# EAGLE board FPGA (EAGLE 5.10)
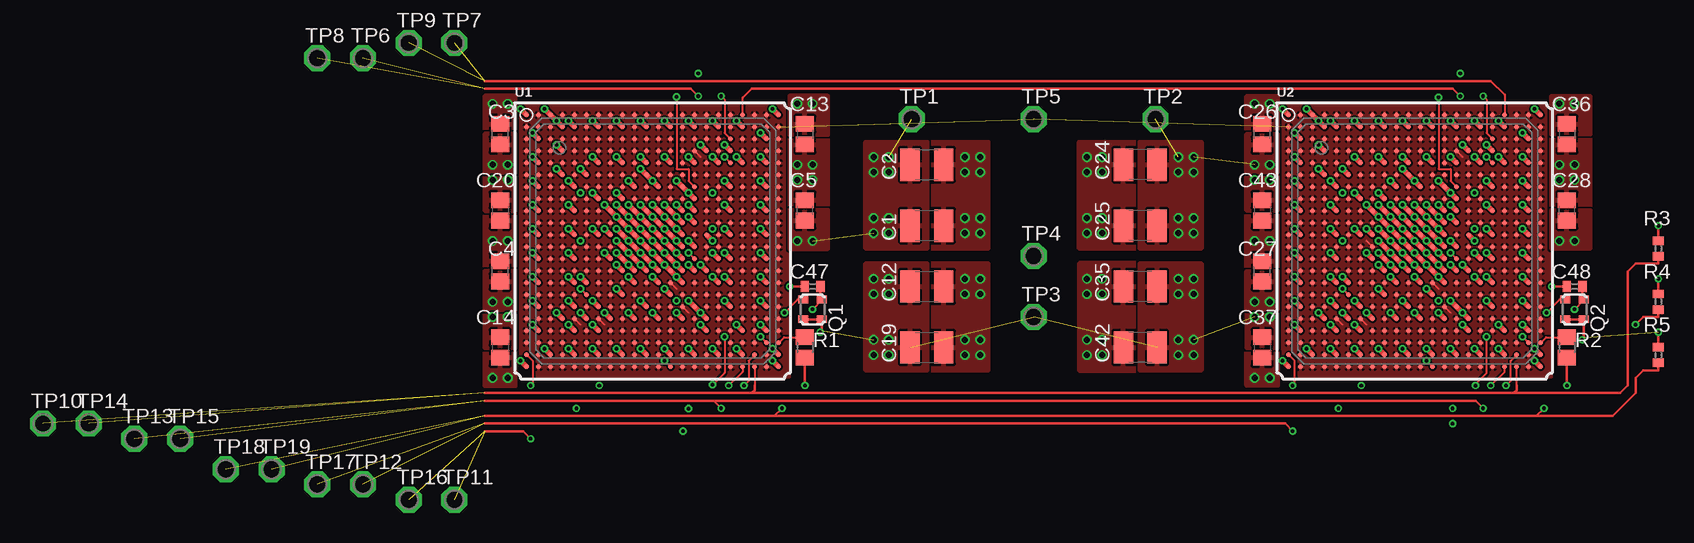
[diagram p5: board, top side]
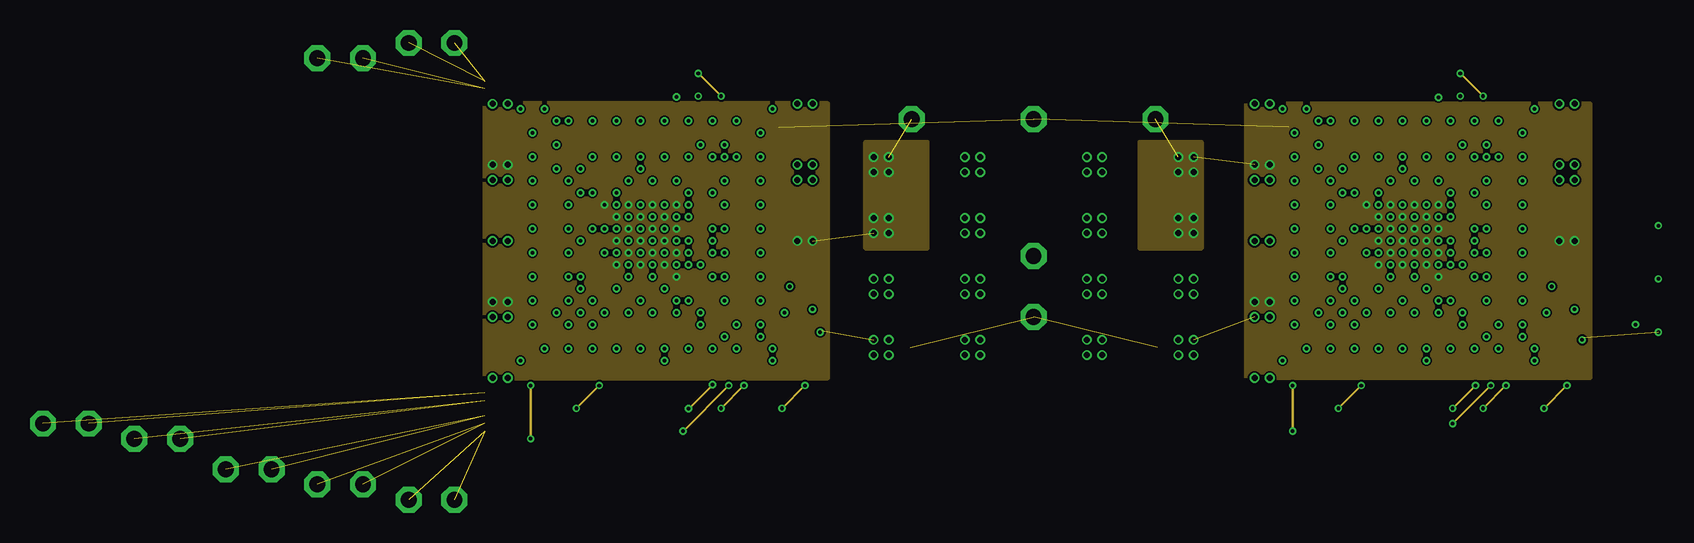
[diagram p6: board, inner layer VCCINT]
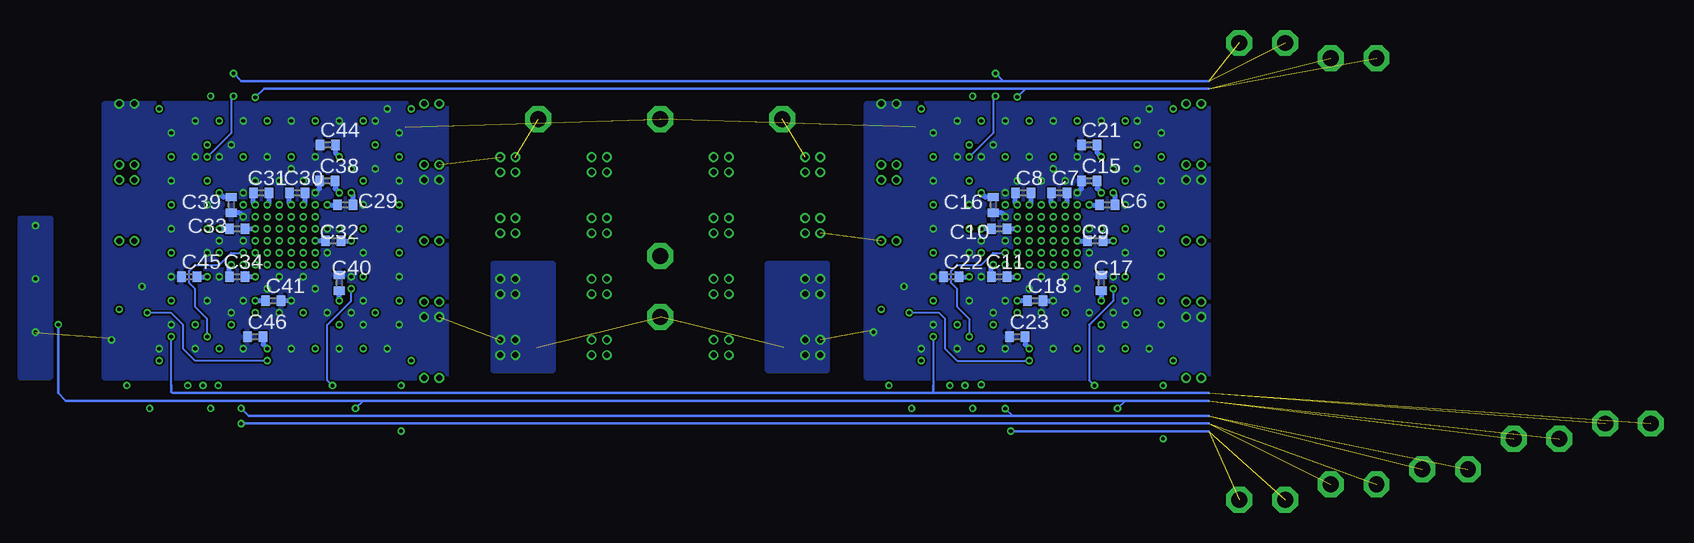
[diagram p7: board, bottom side, seen from below]

No outline drawn. Coordinates in mm, seen from the top.
Copper layers (1+2*15+16): Top 0.035mm / dielectric 0.1mm / $GND 0.035mm / dielectric 0.86mm / VCCINT 0.035mm / dielectric 0.1mm / Bottom 0.035mm
Design rules "pcbcart": minimum track width 0.15mm, minimum drill 0.3mm, track to track 0.15mm, track to pad 0.15mm, pad to pad 0.15mm, via to via 0.15mm, smd to smd 0.15mm, copper to edge 0.3mm, drill to drill 0.2mm, minimum pad ring 0.2mm, minimum via ring 0.15mm, stop-mask expansion 0.075mm, vias tented up to drill 0mil, thermal gap 0.2mm

## Footprints (pad centres in the part's own frame; a part is rotated, then mirrored left to right if it is on the bottom)
C3225 = smd 1.6 x 2.7: 1 -1.4,0; 2 1.4,0
C2012 = smd 1.3 x 1.5: 1 -0.85,0; 2 0.85,0
C1005 = smd 0.7 x 0.9: 1 -0.65,0; 2 0.65,0
ASD = smd 0.65 x 0.85: 1 -0.825,-0.775; 2 0.825,-0.775; 3 0.825,0.775; 4 -0.825,0.775
R2012 = smd 1.3 x 1.5: 1 -0.85,0; 2 0.85,0
R1005 = smd 0.7 x 0.9: 1 -0.65,0; 2 0.65,0
P1-13 = drill 1.321 pad 2.159 octagon: TP 0,0
FG484 = smd 0.4 x 0.4: A1 -10.5,10.5; A2 -9.5,10.5; A3 -8.5,10.5; A4 -7.5,10.5; A5 -6.5,10.5; A6 -5.5,10.5; A7 -4.5,10.5; A8 -3.5,10.5; A9 -2.5,10.5; A10 -1.5,10.5; A11 -0.5,10.5; A12 0.5,10.5; A13 1.5,10.5; A14 2.5,10.5; A15 3.5,10.5; A16 4.5,10.5; A17 5.5,10.5; A18 6.5,10.5; A19 7.5,10.5; A20 8.5,10.5; A21 9.5,10.5; A22 10.5,10.5; AA1 -10.5,-9.5; AA2 -9.5,-9.5; AA3 -8.5,-9.5; AA4 -7.5,-9.5; AA5 -6.5,-9.5; AA6 -5.5,-9.5; AA7 -4.5,-9.5; AA8 -3.5,-9.5; AA9 -2.5,-9.5; AA10 -1.5,-9.5; AA11 -0.5,-9.5; AA12 0.5,-9.5; AA13 1.5,-9.5; AA14 2.5,-9.5; AA15 3.5,-9.5; AA16 4.5,-9.5; AA17 5.5,-9.5; AA18 6.5,-9.5; AA19 7.5,-9.5; AA20 8.5,-9.5; AA21 9.5,-9.5; AA22 10.5,-9.5; AB1 -10.5,-10.5; AB2 -9.5,-10.5; AB3 -8.5,-10.5; AB4 -7.5,-10.5; AB5 -6.5,-10.5; AB6 -5.5,-10.5; AB7 -4.5,-10.5; AB8 -3.5,-10.5; AB9 -2.5,-10.5; AB10 -1.5,-10.5; AB11 -0.5,-10.5; AB12 0.5,-10.5; AB13 1.5,-10.5; AB14 2.5,-10.5; AB15 3.5,-10.5; AB16 4.5,-10.5; AB17 5.5,-10.5; AB18 6.5,-10.5; AB19 7.5,-10.5; AB20 8.5,-10.5; AB21 9.5,-10.5; AB22 10.5,-10.5; B1 -10.5,9.5; B2 -9.5,9.5; B3 -8.5,9.5; B4 -7.5,9.5; B5 -6.5,9.5; B6 -5.5,9.5; B7 -4.5,9.5; B8 -3.5,9.5; B9 -2.5,9.5; B10 -1.5,9.5; B11 -0.5,9.5; B12 0.5,9.5; B13 1.5,9.5; B14 2.5,9.5; B15 3.5,9.5; B16 4.5,9.5; B17 5.5,9.5; B18 6.5,9.5; B19 7.5,9.5; B20 8.5,9.5; B21 9.5,9.5; B22 10.5,9.5; C1 -10.5,8.5; C2 -9.5,8.5; C3 -8.5,8.5; C4 -7.5,8.5; C5 -6.5,8.5; C6 -5.5,8.5; C7 -4.5,8.5; C8 -3.5,8.5; C9 -2.5,8.5; C10 -1.5,8.5; C11 -0.5,8.5; C12 0.5,8.5; C13 1.5,8.5; C14 2.5,8.5; C15 3.5,8.5; C16 4.5,8.5; C17 5.5,8.5; C18 6.5,8.5; C19 7.5,8.5; C20 8.5,8.5; C21 9.5,8.5; C22 10.5,8.5; D1 -10.5,7.5; D2 -9.5,7.5; D3 -8.5,7.5; D4 -7.5,7.5; D5 -6.5,7.5; D6 -5.5,7.5; D7 -4.5,7.5; D8 -3.5,7.5; D9 -2.5,7.5; D10 -1.5,7.5; D11 -0.5,7.5; D12 0.5,7.5; D13 1.5,7.5; D14 2.5,7.5; D15 3.5,7.5; D16 4.5,7.5; D17 5.5,7.5; D18 6.5,7.5; D19 7.5,7.5; D20 8.5,7.5; D21 9.5,7.5; D22 10.5,7.5; E1 -10.5,6.5; E2 -9.5,6.5; E3 -8.5,6.5; E4 -7.5,6.5; E5 -6.5,6.5; E6 -5.5,6.5; E7 -4.5,6.5; E8 -3.5,6.5; E9 -2.5,6.5; E10 -1.5,6.5; E11 -0.5,6.5; E12 0.5,6.5; E13 1.5,6.5; E14 2.5,6.5; E15 3.5,6.5; E16 4.5,6.5; E17 5.5,6.5; E18 6.5,6.5; E19 7.5,6.5; E20 8.5,6.5; E21 9.5,6.5; E22 10.5,6.5; F1 -10.5,5.5; F2 -9.5,5.5; F3 -8.5,5.5; F4 -7.5,5.5; F5 -6.5,5.5; F6 -5.5,5.5; F7 -4.5,5.5; F8 -3.5,5.5; F9 -2.5,5.5; F10 -1.5,5.5; F11 -0.5,5.5; F12 0.5,5.5; F13 1.5,5.5; F14 2.5,5.5; F15 3.5,5.5; F16 4.5,5.5; F17 5.5,5.5; F18 6.5,5.5; F19 7.5,5.5; F20 8.5,5.5; F21 9.5,5.5; F22 10.5,5.5; G1 -10.5,4.5; G2 -9.5,4.5; G3 -8.5,4.5; G4 -7.5,4.5; G5 -6.5,4.5; G6 -5.5,4.5; G7 -4.5,4.5; G8 -3.5,4.5; G9 -2.5,4.5; G10 -1.5,4.5; G11 -0.5,4.5; G12 0.5,4.5; G13 1.5,4.5; G14 2.5,4.5; G15 3.5,4.5; G16 4.5,4.5; G17 5.5,4.5; G18 6.5,4.5; G19 7.5,4.5; G20 8.5,4.5; G21 9.5,4.5; G22 10.5,4.5; H1 -10.5,3.5; H2 -9.5,3.5; H3 -8.5,3.5; H4 -7.5,3.5; H5 -6.5,3.5; H6 -5.5,3.5; H7 -4.5,3.5; H8 -3.5,3.5; H9 -2.5,3.5; H10 -1.5,3.5; H11 -0.5,3.5; H12 0.5,3.5; H13 1.5,3.5; H14 2.5,3.5; H15 3.5,3.5; H16 4.5,3.5; H17 5.5,3.5; H18 6.5,3.5; H19 7.5,3.5; H20 8.5,3.5; H21 9.5,3.5; H22 10.5,3.5; J1 -10.5,2.5; J2 -9.5,2.5; J3 -8.5,2.5; J4 -7.5,2.5; J5 -6.5,2.5; J6 -5.5,2.5; J7 -4.5,2.5; J8 -3.5,2.5; J9 -2.5,2.5; J10 -1.5,2.5; J11 -0.5,2.5; J12 0.5,2.5; J13 1.5,2.5; J14 2.5,2.5; J15 3.5,2.5; J16 4.5,2.5; J17 5.5,2.5; J18 6.5,2.5; J19 7.5,2.5; J20 8.5,2.5; J21 9.5,2.5; J22 10.5,2.5; K1 -10.5,1.5; K2 -9.5,1.5; K3 -8.5,1.5; K4 -7.5,1.5; K5 -6.5,1.5; K6 -5.5,1.5; K7 -4.5,1.5; K8 -3.5,1.5; K9 -2.5,1.5; K10 -1.5,1.5; K11 -0.5,1.5; K12 0.5,1.5; K13 1.5,1.5; K14 2.5,1.5; K15 3.5,1.5; K16 4.5,1.5; K17 5.5,1.5; K18 6.5,1.5; K19 7.5,1.5; K20 8.5,1.5; K21 9.5,1.5; K22 10.5,1.5; L1 -10.5,0.5; L2 -9.5,0.5; L3 -8.5,0.5; L4 -7.5,0.5; L5 -6.5,0.5; L6 -5.5,0.5; L7 -4.5,0.5; L8 -3.5,0.5; L9 -2.5,0.5; L10 -1.5,0.5; L11 -0.5,0.5; L12 0.5,0.5; L13 1.5,0.5; L14 2.5,0.5; L15 3.5,0.5; L16 4.5,0.5; L17 5.5,0.5; L18 6.5,0.5; L19 7.5,0.5; L20 8.5,0.5; L21 9.5,0.5; L22 10.5,0.5; M1 -10.5,-0.5; M2 -9.5,-0.5; M3 -8.5,-0.5; M4 -7.5,-0.5; M5 -6.5,-0.5; M6 -5.5,-0.5; M7 -4.5,-0.5; M8 -3.5,-0.5; M9 -2.5,-0.5; M10 -1.5,-0.5; M11 -0.5,-0.5; M12 0.5,-0.5; M13 1.5,-0.5; M14 2.5,-0.5; M15 3.5,-0.5; M16 4.5,-0.5; M17 5.5,-0.5; M18 6.5,-0.5; M19 7.5,-0.5; M20 8.5,-0.5; M21 9.5,-0.5; M22 10.5,-0.5; N1 -10.5,-1.5; N2 -9.5,-1.5; N3 -8.5,-1.5; N4 -7.5,-1.5; N5 -6.5,-1.5; N6 -5.5,-1.5; N7 -4.5,-1.5; N8 -3.5,-1.5; N9 -2.5,-1.5; N10 -1.5,-1.5; N11 -0.5,-1.5; N12 0.5,-1.5; N13 1.5,-1.5; N14 2.5,-1.5; N15 3.5,-1.5; N16 4.5,-1.5; N17 5.5,-1.5; N18 6.5,-1.5; N19 7.5,-1.5; N20 8.5,-1.5; N21 9.5,-1.5; N22 10.5,-1.5; P1 -10.5,-2.5; P2 -9.5,-2.5; P3 -8.5,-2.5; P4 -7.5,-2.5; P5 -6.5,-2.5; P6 -5.5,-2.5; P7 -4.5,-2.5; P8 -3.5,-2.5; P9 -2.5,-2.5; P10 -1.5,-2.5; P11 -0.5,-2.5; P12 0.5,-2.5; P13 1.5,-2.5; P14 2.5,-2.5; P15 3.5,-2.5; P16 4.5,-2.5; P17 5.5,-2.5; P18 6.5,-2.5; P19 7.5,-2.5; P20 8.5,-2.5; P21 9.5,-2.5; P22 10.5,-2.5; R1 -10.5,-3.5; R2 -9.5,-3.5; R3 -8.5,-3.5; R4 -7.5,-3.5; R5 -6.5,-3.5; R6 -5.5,-3.5; R7 -4.5,-3.5; R8 -3.5,-3.5; R9 -2.5,-3.5; R10 -1.5,-3.5; R11 -0.5,-3.5; R12 0.5,-3.5; R13 1.5,-3.5; R14 2.5,-3.5; R15 3.5,-3.5; R16 4.5,-3.5; R17 5.5,-3.5; R18 6.5,-3.5; R19 7.5,-3.5; R20 8.5,-3.5; R21 9.5,-3.5; R22 10.5,-3.5; T1 -10.5,-4.5; T2 -9.5,-4.5; T3 -8.5,-4.5; T4 -7.5,-4.5; T5 -6.5,-4.5; T6 -5.5,-4.5; T7 -4.5,-4.5; T8 -3.5,-4.5; T9 -2.5,-4.5; T10 -1.5,-4.5; T11 -0.5,-4.5; T12 0.5,-4.5; T13 1.5,-4.5; T14 2.5,-4.5; T15 3.5,-4.5; T16 4.5,-4.5; T17 5.5,-4.5; T18 6.5,-4.5; T19 7.5,-4.5; T20 8.5,-4.5; T21 9.5,-4.5; T22 10.5,-4.5; U1 -10.5,-5.5; U2 -9.5,-5.5; U3 -8.5,-5.5; U4 -7.5,-5.5; U5 -6.5,-5.5; U6 -5.5,-5.5; U7 -4.5,-5.5; U8 -3.5,-5.5; U9 -2.5,-5.5; U10 -1.5,-5.5; U11 -0.5,-5.5; U12 0.5,-5.5; U13 1.5,-5.5; U14 2.5,-5.5; U15 3.5,-5.5; U16 4.5,-5.5; U17 5.5,-5.5; U18 6.5,-5.5; U19 7.5,-5.5; U20 8.5,-5.5; U21 9.5,-5.5; U22 10.5,-5.5; V1 -10.5,-6.5; V2 -9.5,-6.5; V3 -8.5,-6.5; V4 -7.5,-6.5; V5 -6.5,-6.5; V6 -5.5,-6.5; V7 -4.5,-6.5; V8 -3.5,-6.5; V9 -2.5,-6.5; V10 -1.5,-6.5; V11 -0.5,-6.5; V12 0.5,-6.5; V13 1.5,-6.5; V14 2.5,-6.5; V15 3.5,-6.5; V16 4.5,-6.5; V17 5.5,-6.5; V18 6.5,-6.5; V19 7.5,-6.5; V20 8.5,-6.5; V21 9.5,-6.5; V22 10.5,-6.5; W1 -10.5,-7.5; W2 -9.5,-7.5; W3 -8.5,-7.5; W4 -7.5,-7.5; W5 -6.5,-7.5; W6 -5.5,-7.5; W7 -4.5,-7.5; W8 -3.5,-7.5; W9 -2.5,-7.5; W10 -1.5,-7.5; W11 -0.5,-7.5; W12 0.5,-7.5; W13 1.5,-7.5; W14 2.5,-7.5; W15 3.5,-7.5; W16 4.5,-7.5; W17 5.5,-7.5; W18 6.5,-7.5; W19 7.5,-7.5; W20 8.5,-7.5; W21 9.5,-7.5; W22 10.5,-7.5; Y1 -10.5,-8.5; Y2 -9.5,-8.5; Y3 -8.5,-8.5; Y4 -7.5,-8.5; Y5 -6.5,-8.5; Y6 -5.5,-8.5; Y7 -4.5,-8.5; Y8 -3.5,-8.5; Y9 -2.5,-8.5; Y10 -1.5,-8.5; Y11 -0.5,-8.5; Y12 0.5,-8.5; Y13 1.5,-8.5; Y14 2.5,-8.5; Y15 3.5,-8.5; Y16 4.5,-8.5; Y17 5.5,-8.5; Y18 6.5,-8.5; Y19 7.5,-8.5; Y20 8.5,-8.5; Y21 9.5,-8.5; Y22 10.5,-8.5

## Placement (x,y rotation side)
C1  100u  [C3225]  22.86,1.27 0 top
C2  100u  [C3225]  22.86,6.35 0 top
C3  4u7  [C2012]  -12.7,8.89 90 top
C4  4u7  [C2012]  -12.7,-2.54 90 top
C5  4u7  [C2012]  12.7,2.54 90 top
C6  470n  [C1005]  -5.5,3 0 bottom
C7  470n  [C1005]  -1.5,4 180 bottom
C8  470n  [C1005]  1.5,4 0 bottom
C9  470n  [C1005]  -4.5,0 0 bottom
C10  470n  [C1005]  3.5,1 180 bottom
C11  470n  [C1005]  3.5,-3 180 bottom
C12  100u  [C3225]  22.86,-3.81 0 top
C13  4u7  [C2012]  12.7,8.89 270 top
C14  4u7  [C2012]  -12.7,-8.89 270 top
C15  470n  [C1005]  -4,5 0 bottom
C16  470n  [C1005]  4,3 90 bottom
C17  470n  [C1005]  -5,-3.5 270 bottom
C18  470n  [C1005]  0.5,-5 180 bottom
C19  100u  [C3225]  22.86,-8.89 0 top
C20  4u7  [C2012]  -12.7,2.54 270 top
C21  470n  [C1005]  -4,8 0 bottom
C22  470n  [C1005]  7.5,-3 0 bottom
C23  470n  [C1005]  2,-8 0 bottom
C24  100u  [C3225]  40.64,6.35 180 top
C25  100u  [C3225]  40.64,1.27 180 top
C26  4u7  [C2012]  50.8,8.89 90 top
C27  4u7  [C2012]  50.8,-2.54 90 top
C28  4u7  [C2012]  76.2,2.54 90 top
C29  470n  [C1005]  58,3 0 bottom
C30  470n  [C1005]  62,4 180 bottom
C31  470n  [C1005]  65,4 0 bottom
C32  470n  [C1005]  59,0 0 bottom
C33  470n  [C1005]  67,1 180 bottom
C34  470n  [C1005]  67,-3 180 bottom
C35  100u  [C3225]  40.64,-3.81 180 top
C36  4u7  [C2012]  76.2,8.89 270 top
C37  4u7  [C2012]  50.8,-8.89 270 top
C38  470n  [C1005]  59.5,5 0 bottom
C39  470n  [C1005]  67.5,3 90 bottom
C40  470n  [C1005]  58.5,-3.5 270 bottom
C41  470n  [C1005]  64,-5 180 bottom
C42  100u  [C3225]  40.64,-8.89 180 top
C43  4u7  [C2012]  50.8,2.54 270 top
C44  470n  [C1005]  59.45,8 0 bottom
C45  470n  [C1005]  71,-3 0 bottom
C46  470n  [C1005]  65.5,-8 0 bottom
C47  470n  [C1005]  13.34,-3.81 0 top
C48  470n  [C1005]  76.83,-3.81 0 top
Q1  ASDMB@100MHZ  [ASD]  13.34,-5.71 90 top
Q2  ASDMB@100MHZ  [ASD]  76.83,-5.71 90 top
R1  0R  [R2012]  12.7,-8.89 270 top
R2  0R  [R2012]  76.2,-8.89 270 top
R3  4k7  [R1005]  83.82,-0.64 90 top
R4  4k7  [R1005]  83.82,-5.08 90 top
R5  4k7  [R1005]  83.82,-9.53 90 top
TP1  TPPAD1-13  [P1-13]  21.59,10.16 0 top
TP2  TPPAD1-13  [P1-13]  41.91,10.16 0 top
TP3  TPPAD1-13  [P1-13]  31.75,-6.35 0 top
TP4  TPPAD1-13  [P1-13]  31.75,-1.27 0 top
TP5  TPPAD1-13  [P1-13]  31.75,10.16 0 top
TP6  TPPAD1-13  [P1-13]  -24.13,15.24 0 top
TP7  TPPAD1-13  [P1-13]  -16.51,16.51 0 top
TP8  TPPAD1-13  [P1-13]  -27.94,15.24 0 top
TP9  TPPAD1-13  [P1-13]  -20.32,16.51 0 top
TP10  TPPAD1-13  [P1-13]  -50.8,-15.24 0 top
TP11  TPPAD1-13  [P1-13]  -16.51,-21.59 0 top
TP12  TPPAD1-13  [P1-13]  -24.13,-20.32 0 top
TP13  TPPAD1-13  [P1-13]  -43.18,-16.51 0 top
TP14  TPPAD1-13  [P1-13]  -46.99,-15.24 0 top
TP15  TPPAD1-13  [P1-13]  -39.37,-16.51 0 top
TP16  TPPAD1-13  [P1-13]  -20.32,-21.59 0 top
TP17  TPPAD1-13  [P1-13]  -27.94,-20.32 0 top
TP18  TPPAD1-13  [P1-13]  -35.56,-19.05 0 top
TP19  TPPAD1-13  [P1-13]  -31.75,-19.05 0 top
U1  6SLX150FGG484  [FG484]  0,0 0 top
U2  6SLX150FGG484  [FG484]  63.5,0 0 top

## Tracks (layer width: path | path; a pad name or v marks a point on that pad's centre or on a via)
!IRQ  (via drill 0.3)  (1 unrouted)
  Top 0.15: v57.5,-4 U2.T6 | U1.T6 v-6,-4
  Top 0.2: v81.92,-6.99 82.55,-6.35 83.82,-6.35 R4.1
  VCCINT 0.2: v-4.45,-12.06 v-6.35,-13.97 | v57.15,-13.97 v59.05,-12.06
  Bottom 0.15: v57.5,-4 57.5,-5 59.5,-7 59.5,-11.62 v59.05,-12.06 | v-6,-4 -6,-5 -4,-7 -4,-11.62 v-4.45,-12.06
  Bottom 0.2: -6.99,-13.34 56.52,-13.34 | v-6.35,-13.97 -6.99,-13.34 | -6.99,-13.34 -13.97,-13.34 | 56.52,-13.34 v57.15,-13.97 | 56.52,-13.34 81.28,-13.34 81.92,-12.7 v81.92,-6.99
!PROGRAM0  (via drill 0.3)  (1 unrouted)
  Top 0.15: U1.AA1 -10,-10 -10,-11.9 v-10.16,-12.06
  Top 0.2: -13.97,-15.88 -10.79,-15.88 v-10.16,-16.51
  VCCINT 0.2: v-10.16,-12.06 v-10.16,-16.51
!PROGRAM1  (via drill 0.3)  (1 unrouted)
  Top 0.15: U2.AA1 53.5,-10 53.5,-11.9 v53.34,-12.06
  Top 0.2: -13.97,-15.24 52.7,-15.24 v53.34,-15.88
  VCCINT 0.2: v53.34,-15.88 v53.34,-12.06
CLK0  (via drill 0.3)
  Top 0.15: v1,-10 U1.AB13
  Top 0.2: v11,-6 12.11,-4.89 Q1.3
  Bottom 0.15: v1,-10 7,-10 8,-9 8,-6.5 8.5,-6 v11,-6
CLK1  (via drill 0.3)
  Top 0.15: U2.AB13 v64.5,-10
  Top 0.2: v74.5,-6 75.61,-4.89 Q2.3
  Bottom 0.15: v64.5,-10 70.5,-10 71.5,-9 71.5,-7 72.5,-6 v74.5,-6
DONE  (via drill 0.3)  (1 unrouted)
  Top 0.2: 10.16,-14.61 -13.97,-14.61 | 10.16,-14.61 73.66,-14.61 | v12.7,-12.06 R1.2 | v10.79,-13.97 10.16,-14.61 | v76.2,-12.06 R2.2 | 73.66,-14.61 v74.3,-13.97 | R5.1 83.82,-10.79 82.55,-10.79 81.92,-11.43 81.92,-12.7 80.01,-14.61 73.66,-14.61
  VCCINT 0.2: v10.79,-13.97 v12.7,-12.06 | v74.3,-13.97 v76.2,-12.06
DONE_0
  Top 0.15: U1.Y22 10.96,-8.04 R1.1
DONE_1
  Top 0.15: U2.Y22 74.46,-8.04 R2.1
GND  (via drill 0.3, 0.5)
  Top 0.2: v13.34,-5.71 14.16,-4.89 Q1.2 13.98,-4.76 C47.2 | C48.2 77.48,-4.76 Q2.2 77.61,-4.94 v76.83,-5.71
  Top 0.4: v-11,-10 U1.AB1 | U1.AA5 v-7,-9 | U1.W7 v-5,-7 | U1.AA9 v-3,-9 | v1,-9 U1.AA13 | U1.AA17 v5,-9 | U1.W16 v4,-7 | U1.V14 v2,-6 | U1.V10 v-2,-6 | v-5,-5 U1.U7 | U1.V4 v-8,-6 | v-10,-5 U1.U2 | U1.R5 v-7,-3 | U1.N2 v-10,-1 | U1.L5 v-7,1 | v-10,3 U1.J2 | U1.E2 v-10,7 | U1.D4 v-8,8 | U1.B5 v-7,10 | U1.E7 v-5,7 | U1.G5 v-7,5 | v-3,10 U1.B9 | U1.E11 v-1,7 | U1.B13 v1,10 | v5,10 U1.B17 | v10,11 U1.A22 | U1.E21 v9,7 | U1.D18 v6,8 | U1.E15 v3,7 | U1.G18 v6,5 | U1.J21 v9,3 | U1.L18 v6,1 | U1.N21 v9,-1 | v5,-1 U1.N17 | U1.U21 v9,-5 | U1.W19 v7,-7 | U1.AB22 v10,-10 | v-5,4 U1.H7 | U1.J15 v3,3 | U1.K14 v2,2 U1.J13 v1,3 | U1.M14 v2,0 U1.L13 v1,1 U1.K12 v0,2 U1.J11 v-1,3 | v4,-2 U1.P16 | v6,-3 U1.R18 | U1.P15 v3,-2 | U1.P14 v2,-2 U1.N13 v1,-1 U1.M12 v0,0 U1.L11 v-1,1 U1.K10 v-2,2 U1.J9 v-3,3 | v-3,1 U1.L9 v-2,0 U1.M10 v-1,-1 U1.N11 v0,-2 U1.P12 | U1.P10 v-2,-2 U1.N9 v-3,-1 | U1.A1 v-11,11 | U2.AB1 v52.5,-10 | U2.AA5 v56.5,-9 | U2.W7 v58.5,-7 | v60.5,-9 U2.AA9 | v64.5,-9 U2.AA13 | v68.5,-9 U2.AA17 | U2.W16 v67.5,-7 | U2.V14 v65.5,-6 | U2.V10 v61.5,-6 | U2.U7 v58.5,-5 | v55.5,-6 U2.V4 | U2.U2 v53.5,-5 | U2.R5 v56.5,-3 | U2.N2 v53.5,-1 | U2.L5 v56.5,1 | U2.J2 v53.5,3 | U2.E2 v53.5,7 | U2.D4 v55.5,8 | U2.B5 v56.5,10 | U2.E7 v58.5,7 | U2.G5 v56.5,5 | v60.5,10 U2.B9 | U2.E11 v62.5,7 | U2.B13 v64.5,10 | v68.5,10 U2.B17 | v73.5,11 U2.A22 | U2.E21 v72.5,7 | U2.D18 v69.5,8 | U2.E15 v66.5,7 | U2.G18 v69.5,5 | U2.J21 v72.5,3 | U2.L18 v69.5,1 | U2.N21 v72.5,-1 | v68.5,-1 U2.N17 | U2.U21 v72.5,-5 | U2.W19 v70.5,-7 | U2.AB22 v73.5,-10 | v58.5,4 U2.H7 | U2.J15 v66.5,3 | U2.K14 v65.5,2 U2.J13 v64.5,3 | U2.M14 v65.5,0 U2.L13 v64.5,1 U2.K12 v63.5,2 U2.J11 v62.5,3 | v67.5,-2 U2.P16 | v69.5,-3 U2.R18 | U2.P15 v66.5,-2 | U2.P14 v65.5,-2 U2.N13 v64.5,-1 U2.M12 v63.5,0 U2.L11 v62.5,1 U2.K10 v61.5,2 U2.J9 v60.5,3
  Top 0.4: v60.5,1 U2.L9 v61.5,0 U2.M10 v62.5,-1 U2.N11 v63.5,-2 U2.P12 | U2.P10 v61.5,-2 U2.N9 v60.5,-1 | U2.A1 v52.5,11
  Bottom 0.4: C15.2 -4.65,4.35 v-5,4 | C22.2 v6,-3 | C11.2 4.15,-2.15 v4,-2 | C8.2 0.85,3.15 v1,3 | C7.2 -0.85,3.15 v-1,3 | C17.2 v-5,-5 | C38.2 58.85,4.35 v58.5,4 | C45.2 v69.5,-3 | C34.2 67.65,-2.15 v67.5,-2 | C31.2 64.35,3.15 v64.5,3 | C30.2 62.65,3.15 v62.5,3 | v58.5,-5 C40.2 | C9.2 v-6,0 | C10.2 v5,1 | C21.2 -4.65,7.35 v-5,7 | C6.2 -6.15,3.85 v-6,4 | C23.2 1.35,-8.65 v1,-9 | C18.2 v2,-5 | C16.2 4.65,3.65 v5,4 | C44.2 58.8,7.3 v58.5,7 | C32.2 v57.5,0 | C29.2 57.35,3.85 v57.5,4 | C41.2 v65.5,-5 | C46.2 64.85,-8.65 v64.5,-9 | C33.2 v68.5,1 | C39.2 68.15,3.65 v68.5,4
  other vias: 12.06,5.08 12.06,6.35 13.34,5.08 13.34,6.35 -13.34,11.43 -12.06,11.43 -13.34,0 -12.06,0 -12.06,-11.43 -13.34,-11.43 51.44,-11.43 50.16,-11.43 50.16,0 51.44,0 51.44,11.43 50.16,11.43 76.83,6.35 75.56,6.35 75.56,5.08 76.83,5.08 26.04,0.64 27.3,0.64 27.3,1.91 26.04,1.91 26.04,5.71 27.3,5.71 27.3,6.99 26.04,6.99 26.04,-3.17 27.3,-3.17 27.3,-4.45 26.04,-4.45 26.04,-8.26 27.3,-8.26 27.3,-9.53 26.04,-9.53 37.47,6.99 36.2,6.99 36.2,5.71 37.47,5.71 37.47,1.91 36.2,0.64 36.2,1.91 37.47,0.64 36.2,-3.17 37.47,-4.45 37.47,-3.17 36.2,-4.45 36.2,-8.26 37.47,-9.53 36.2,-9.53 37.47,-8.26
  pour Top (rank 3): -13.97,-8.89 -13.97,-12.06 -11.43,-12.06 -11.43,-8.89
  pour Top (rank 3): -13.97,2.54 -13.97,-2.54 -11.43,-2.54 -11.43,2.54
  pour Top (rank 3): -13.97,12.06 -13.97,8.89 -11.43,8.89 -11.43,12.06
  pour Top (rank 3): 11.43,8.89 11.43,2.54 14.61,2.54 14.61,8.89
  pour Top (rank 3): 49.53,12.06 52.07,12.06 52.07,8.89 49.53,8.89
  pour Top (rank 3): 49.53,2.54 52.07,2.54 52.07,-2.54 49.53,-2.54
  pour Top (rank 3): 49.53,-8.89 52.07,-8.89 52.07,-12.06 49.53,-12.06
  pour Top (rank 3): 74.93,8.89 78.11,8.89 78.11,2.54 74.93,2.54
  pour Top (rank 3): 22.86,8.26 27.94,8.26 27.94,-0.64 22.86,-0.64
  pour Top (rank 3): 22.86,-1.91 27.94,-1.91 27.94,-10.79 22.86,-10.79
  pour Top (rank 3): 40.64,-1.91 35.56,-1.91 35.56,-10.79 40.64,-10.79
  pour Top (rank 3): 40.64,-0.64 35.56,-0.64 35.56,8.26 40.64,8.26
MISO_F  (1 unrouted)
  Top 0.15: U1.AB20 8.5,-12.06 | 72,-12.06 U2.AB20
  Top 0.2: 8.26,-12.7 71.75,-12.7 | 71.75,-12.7 80.64,-12.7 81.28,-12.06 81.28,-2.54 81.92,-1.91 83.82,-1.91 R3.1 | 8.26,-12.7 -13.97,-12.7 | 8.5,-12.06 8.5,-12.46 8.26,-12.7 | 72,-12.06 72,-12.46 71.75,-12.7
MOSI_F  (via drill 0.3)  (1 unrouted)
  Top 0.15: U2.AA20 71.5,-10 71.5,-11.69 v71.12,-12.06 | U1.AA20 8,-10 8,-11.69 v7.62,-12.06
  Top 0.2: 5.08,-13.34 -13.97,-13.34 | 5.08,-13.34 68.58,-13.34 v69.22,-13.97 | v5.71,-13.97 5.08,-13.34
  VCCINT 0.2: v7.62,-12.06 v5.71,-13.97 | v69.22,-13.97 v71.12,-12.06
NC  (2 unrouted)
  Top 0.15: U2.R13 65.5,-4 | U2.M8 59.5,0 | U2.V7 59.5,-7 | U2.V5 57.5,-7 | U2.D15 67.5,7 | U2.U14 66.5,-6 | U1.V5 -6,-7 | U1.V7 -4,-7 | 3,-6 U1.U14 | U1.R13 2,-4 | U1.D15 4,7
  pour Top (rank 4): -11.43,11.43 11.43,11.43 11.43,-11.43 -11.43,-11.43
  pour Top (rank 4): 52.07,11.43 74.93,11.43 74.93,-11.43 52.07,-11.43
SCLK_F  (via drill 0.3)  (1 unrouted)
  Top 0.15: v72.5,-8 U2.Y21 | U1.Y21 v9,-8
  Bottom 0.15: 72.5,-12.06 v72.5,-8 | v9,-8 9,-12.06
  Bottom 0.2: 8.89,-12.7 -13.97,-12.7 | 8.89,-12.7 72.39,-12.7 72.5,-12.59 72.5,-12.06 | 9,-12.06 9,-12.59 8.89,-12.7
SSEL_F0  (via drill 0.3)  (1 unrouted)
  Top 0.15: v6.35,-12.06 7.5,-10.91 U1.AB19
  VCCINT 0.2: v6.35,-12.06 v2.54,-15.88
  Bottom 0.2: v2.54,-15.88 -13.97,-15.88
SSEL_F1  (via drill 0.3)  (1 unrouted)
  Top 0.15: v69.85,-12.06 71,-10.91 U2.AB19
  VCCINT 0.2: v66.67,-15.24 v69.85,-12.06
  Bottom 0.2: -13.97,-15.24 v66.67,-15.24
SUSPEND  (via drill 0.3)  (1 unrouted)
  Top 0.15: v3,-1 U1.N15 | v6,-8 6,-11 v5,-12 | v66.5,-1 U2.N15 | v69.5,-8 69.5,-11 68.58,-11.92 v68.58,-12.06
  VCCINT 0.2: v5,-12 v3,-14 | v66.67,-13.97 v68.58,-12.06
  Bottom 0.15: v3,-1 4,-1 5,-2 7,-2 7.5,-2.5 7.5,-3.5 7,-4 7,-5.5 6,-6.5 v6,-8 | v66.5,-1 67.5,-1 68.5,-2 70.5,-2 71,-2.5 71,-3.5 70.5,-4 70.5,-5.5 69.5,-6.5 v69.5,-8
  Bottom 0.2: v3,-14 2.4,-14.61 | 2.4,-14.61 -13.97,-14.61 | v66.67,-13.97 66.04,-14.61 2.4,-14.61
TCK  (via drill 0.3)  (1 unrouted)
  Top 0.15: U2.G15 66.5,5 66.5,6 65.5,6 v65.5,11.97 | U1.G15 3,5 3,6 2,6 v2,12
  Bottom 0.2: 1.3,12.7 v2,12 | -13.97,12.7 1.3,12.7 | 1.3,12.7 64.77,12.7 v65.5,11.97
TDI0  (via drill 0.3)  (1 unrouted)
  Top 0.15: v6,7 U1.E18
  Top 0.2: v3.81,12.06 3.17,12.7 -13.97,12.7
  Bottom 0.15: v6,7 4,9 4,11.88 v3.81,12.06
TDO0I1  (via drill 0.3)
  Top 0.15: U1.A19 7.5,11.95 | v69.5,7 U2.E18
  Top 0.2: 7.5,11.95 8.26,12.7 66.67,12.7 v67.31,12.06
  Bottom 0.15: v69.5,7 67.5,9 67.5,11.88 v67.31,12.06
TDO1  (1 unrouted)
  Top 0.15: 71,12.19 U2.A19
  Top 0.2: -13.97,13.34 69.85,13.34 71,12.19
TMS  (via drill 0.3)  (1 unrouted)
  Top 0.15: U2.C18 69.5,9 69.5,11.78 v69.22,12.06 | U1.C18 6,9 6,11.78 v5.71,12.06
  VCCINT 0.2: v3.81,13.97 v5.71,12.06 | v67.31,13.97 v69.22,12.06
  Bottom 0.2: -13.97,13.34 3.17,13.34 | 3.17,13.34 66.67,13.34 v67.31,13.97 | 3.17,13.34 v3.81,13.97
VCCINT0  (via drill 0.3, 0.5)  (2 unrouted)
  Top 0.4: v-2,3 U1.J10 v-1,2 U1.K11 v0,1 U1.L12 v1,0 U1.M13 v2,-1 U1.N14 | U1.R14 v2,-3 U1.P13 v1,-2 U1.N12 v0,-1 U1.M11 v-1,0 U1.L10 v-2,1 U1.K9 v-3,2 U1.J8 v-4,3 | U1.P11 v-1,-2 U1.N10 v-2,-1 U1.M9 v-3,0 | U1.P9 v-3,-2 | U1.L14 v2,1 U1.K13 v1,2 U1.J12 v0,3 | U1.J14 v2,3
  Bottom 0.4: C11.1 v2,-3 | C7.1 -2.15,3.15 v-2,3 | C8.1 2.15,3.15 v2,3 | v-3,0 C9.1 | v2,1 C10.1 | v-4,3 C6.1
  other vias: 12.06,0 13.34,0 -13.34,-5.08 -12.06,-5.08 -13.34,6.35 -12.06,6.35 18.41,6.99 19.68,6.99 19.68,5.71 18.41,5.71 18.41,1.91 18.41,0.64 19.68,0.64 19.68,1.91
  pour VCCINT: 14.61,11.43 -13.97,11.43 -13.97,-11.43 14.61,-11.43
  pour Top: -13.97,-2.54 -13.97,-5.71 -11.43,-5.71 -11.43,-2.54
  pour Top: -13.97,8.89 -13.97,5.71 -11.43,5.71 -11.43,8.89
  pour Top: 11.43,2.54 11.43,-0.64 14.61,-0.64 14.61,2.54
  pour Top: 17.78,8.26 22.86,8.26 22.86,-0.64 17.78,-0.64
  pour VCCINT: 17.78,8.26 22.86,8.26 22.86,-0.64 17.78,-0.64
VCCINT1  (via drill 0.3, 0.5)  (2 unrouted)
  Top 0.4: v61.5,3 U2.J10 v62.5,2 U2.K11 v63.5,1 U2.L12 v64.5,0 U2.M13 v65.5,-1 U2.N14 | U2.R14 v65.5,-3 U2.P13 v64.5,-2 U2.N12 v63.5,-1 U2.M11 v62.5,0 U2.L10 v61.5,1 U2.K9 v60.5,2 U2.J8 v59.5,3 | U2.P11 v62.5,-2 U2.N10 v61.5,-1 U2.M9 v60.5,0 | v60.5,-2 U2.P9 | U2.L14 v65.5,1 U2.K13 v64.5,2 U2.J12 v63.5,3 | U2.J14 v65.5,3
  Bottom 0.4: C32.1 v60.5,0 | v65.5,-3 C34.1 | v65.5,1 C33.1 | C30.1 61.35,3.15 v61.5,3 | C31.1 65.65,3.15 v65.5,3 | v59.5,3 C29.1
  other vias: 76.83,0 75.56,0 50.16,-5.08 51.44,-5.08 50.16,6.35 51.44,6.35 45.09,0.64 43.81,0.64 43.81,1.91 45.09,1.91 45.09,5.71 43.81,5.71 43.81,6.99 45.09,6.99
  pour VCCINT: 49.53,11.43 78.11,11.43 78.11,-11.43 49.53,-11.43
  pour Top: 74.93,2.54 78.11,2.54 78.11,-0.64 74.93,-0.64
  pour Top: 49.53,-2.54 52.07,-2.54 52.07,-5.71 49.53,-5.71
  pour Top: 49.53,8.89 52.07,8.89 52.07,5.71 49.53,5.71
  pour Top: 40.64,8.26 45.72,8.26 45.72,-0.64 40.64,-0.64
  pour VCCINT: 40.64,8.26 45.72,8.26 45.72,-0.64 40.64,-0.64
VCCIO  (via drill 0.3, 0.5)  (5 unrouted)
  Top 0.2: R5.2 v83.82,-7.62 | R4.2 v83.82,-3.17 | R3.2 v83.82,1.27 | C48.1 v74.93,-3.81 | C47.1 v11.43,-3.81 | Q1.4 Q1.1 14.11,-7.48 v13.97,-7.62 | Q2.4 Q2.1 77.61,-8.12 v77.47,-8.26
  Top 0.4: U1.E13 v1,7 | v2,5 U1.G14 v3,4 U1.H15 | U1.L16 v5,0 | U1.J18 v6,3 | U1.N18 v6,-1 | U1.L21 v9,1 | U1.G21 v9,5 | U1.E19 v7,7 | v5,7 U1.E17 | U1.C21 v9,9 | U1.B19 v7,10 | U1.B15 v3,10 | U1.B11 v-1,10 | U1.B7 v-5,10 | U1.F6 v-6,6 | v-8,10 U1.B4 | v-8,10 U1.A3 | v-8,10 v-9,11 | U1.C2 v-10,9 | v-3,7 U1.E9 | U1.F4 v-8,6 | U1.G2 v-10,5 | v-7,3 U1.J5 | U1.L7 v-5,1 | U1.L2 v-10,1 | U1.N5 v-7,-1 | U1.R2 v-10,-3 | v-7,-5 U1.U5 | U1.V8 v-4,-6 | U1.T9 v-3,-4 | U1.V12 v0,-6 | U1.T13 v1,-4 | U1.W2 v-10,-7 | U1.AA3 v-9,-9 | U1.W5 v-7,-7 | U1.AA7 v-5,-9 | U1.AA11 v-1,-9 | U1.AA15 v3,-9 | v10,-9 U1.AA22 | U1.W21 v9,-7 | U1.AA19 v7,-9 | U1.U18 v6,-5 | v5,-3 U1.R17 | U1.R21 v9,-3 | U1.V16 v4,-6 U1.U15 v3,-5 | U1.G10 v-2,5 | U1.G12 v0,5 U1.F11 v-1,6 | U1.M15 v3,0 | U1.D16 v4,8 | U1.L8 v-4,1 | U1.R6 v-6,-3 | U1.V6 v-6,-6 | U1.R10 v-2,-3 | U1.N8 v-4,-1 | v-1,-5 U1.U11 | U1.R12 v0,-3 | v-3,4 U1.H9 | U2.E13 v64.5,7 | v65.5,5 U2.G14 v66.5,4 U2.H15 | U2.L16 v68.5,0 | U2.J18 v69.5,3 | U2.N18 v69.5,-1 | U2.L21 v72.5,1 | U2.G21 v72.5,5 | U2.E19 v70.5,7 | v68.5,7 U2.E17 | U2.C21 v72.5,9 | U2.B19 v70.5,10 | U2.B15 v66.5,10 | U2.B11 v62.5,10 | U2.B7 v58.5,10 | U2.F6 v57.5,6 | v55.5,10 U2.B4 | v55.5,10 U2.A3 | v55.5,10 v54.5,11 | U2.C2 v53.5,9 | v60.5,7 U2.E9 | v55.5,6 U2.F4 | U2.G2 v53.5,5 | U2.J5 v56.5,3 | U2.L7 v58.5,1 | U2.L2 v53.5,1 | U2.N5 v56.5,-1 | U2.R2 v53.5,-3 | U2.U5 v56.5,-5 | U2.V8 v59.5,-6 | v60.5,-4 U2.T9 | U2.V12 v63.5,-6 | U2.T13 v64.5,-4 | U2.W2 v53.5,-7 | U2.AA3 v54.5,-9 | U2.W5 v56.5,-7 | U2.AA7 v58.5,-9 | U2.AA11 v62.5,-9 | U2.AA15 v66.5,-9 | v73.5,-9 U2.AA22 | U2.W21 v72.5,-7 | U2.AA19 v70.5,-9 | U2.U18 v69.5,-5 | v68.5,-3 U2.R17 | U2.R21 v72.5,-3 | U2.V16 v67.5,-6 U2.U15 v66.5,-5 | U2.G10 v61.5,5 | U2.G12 v63.5,5 U2.F11 v62.5,6 | v66.5,2 U2.K15 | U2.M15 v66.5,0 | U2.D16 v67.5,8 | U2.L8 v59.5,1 | U2.R6 v57.5,-3
  Top 0.4: U2.V6 v57.5,-6 | U2.R10 v61.5,-3 | U2.N8 v59.5,-1 | U2.U11 v62.5,-5 | U2.R12 v63.5,-3 | v60.5,4 U2.H9 | v3,2 U1.K15
  Bottom 0.4: v-3,4 -3.35,4.35 C15.1 | C18.1 v-1,-5 | C16.1 3.35,2.35 v3,2 | v60.5,4 60.15,4.35 C38.1 | v62.5,-5 C41.1 | C39.1 66.85,2.35 v66.5,2
  other vias: 12.06,11.43 13.34,11.43 -13.34,5.08 -12.06,5.08 -13.34,-6.35 -12.06,-6.35 51.44,-6.35 50.16,-6.35 50.16,5.08 51.44,5.08 76.83,11.43 75.56,11.43 19.68,-9.53 18.41,-9.53 18.41,-8.26 19.68,-8.26 19.68,-4.45 18.41,-4.45 18.41,-3.17 19.68,-3.17 43.81,-9.53 45.09,-9.53 45.09,-8.26 43.81,-8.26 43.81,-4.45 45.09,-4.45 45.09,-3.17 43.81,-3.17
  pour Bottom: -13.97,11.43 14.61,11.43 14.61,-11.43 -13.97,-11.43
  pour Bottom: 49.53,11.43 78.11,11.43 78.11,-11.43 49.53,-11.43
  pour Top (rank 2): 49.53,5.71 52.07,5.71 52.07,2.54 49.53,2.54
  pour Top (rank 2): 74.93,12.06 78.11,12.06 78.11,8.89 74.93,8.89
  pour Top (rank 2): 49.53,-8.89 52.07,-8.89 52.07,-5.71 49.53,-5.71
  pour Top (rank 2): -13.97,5.71 -13.97,2.54 -11.43,2.54 -11.43,5.71
  pour Top (rank 2): -13.97,-5.71 -13.97,-8.89 -11.43,-8.89 -11.43,-5.71
  pour Top: 11.43,12.06 11.43,8.89 14.61,8.89 14.61,12.06
  pour Bottom: 82.55,1.91 82.55,-11.43 85.09,-11.43 85.09,1.91
  pour Top (rank 2): 17.78,-1.91 22.86,-1.91 22.86,-10.79 17.78,-10.79
  pour Top (rank 2): 40.64,-1.91 45.72,-1.91 45.72,-10.79 40.64,-10.79
  pour Bottom: 17.78,-1.91 22.86,-1.91 22.86,-10.79 17.78,-10.79
  pour Bottom: 40.64,-1.91 45.72,-1.91 45.72,-10.79 40.64,-10.79